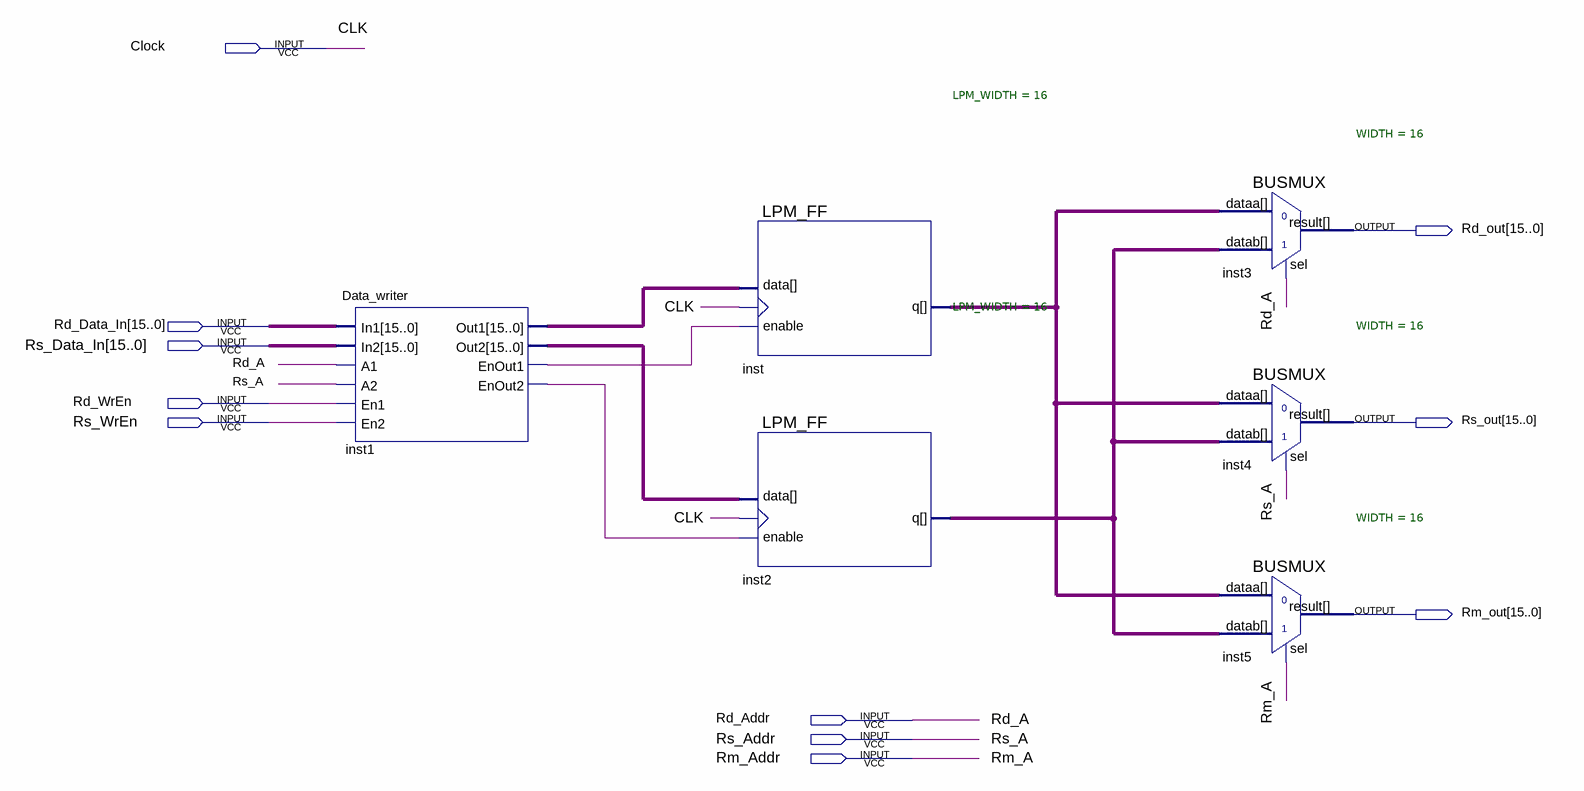
[diagram p0: schematic sheet]
// Quartus schematic Reg_Level0.bdf as structural Verilog: 6 symbols, 11 pins
module Reg_Level0 (
  input  Clock,
  input  [15:0] Rd_Data_In,
  input  [15:0] Rs_Data_In,
  input  Rd_WrEn,
  input  Rs_WrEn,
  input  Rd_Addr,
  input  Rs_Addr,
  input  Rm_Addr,
  output [15:0] Rd_out,
  output [15:0] Rs_out,
  output [15:0] Rm_out
);

  wire inst1_enout1, inst1_enout2;
  wire [15:0] inst1_out1, inst1_out2, inst2_q, inst_q;

  Data_writer inst1 (
    .In1(Rd_Data_In), .In2(Rs_Data_In), .A1(Rd_Addr), .A2(Rs_Addr), .En1(Rd_WrEn), .En2(Rs_WrEn),
    .Out1(inst1_out1), .Out2(inst1_out2), .EnOut1(inst1_enout1), .EnOut2(inst1_enout2));
  LPM_FF #(.LPM_WIDTH(16)) inst (.clock(Clock), .data(inst1_out1), .enable(inst1_enout1), .q(inst_q));
  LPM_FF #(.LPM_WIDTH(16)) inst2 (.clock(Clock), .data(inst1_out2), .enable(inst1_enout2), .q(inst2_q));
  BUSMUX #(.WIDTH(16)) inst3 (.datab(inst2_q), .sel(Rd_Addr), .dataa(inst_q), .result(Rd_out));
  BUSMUX #(.WIDTH(16)) inst4 (.datab(inst2_q), .sel(Rs_Addr), .dataa(inst_q), .result(Rs_out));
  BUSMUX #(.WIDTH(16)) inst5 (.datab(inst2_q), .sel(Rm_Addr), .dataa(inst_q), .result(Rm_out));

  // Other names for the same wires on the sheet: CLK = Clock; Rd_A = Rd_Addr; Rm_A = Rm_Addr; Rs_A = Rs_Addr
endmodule
